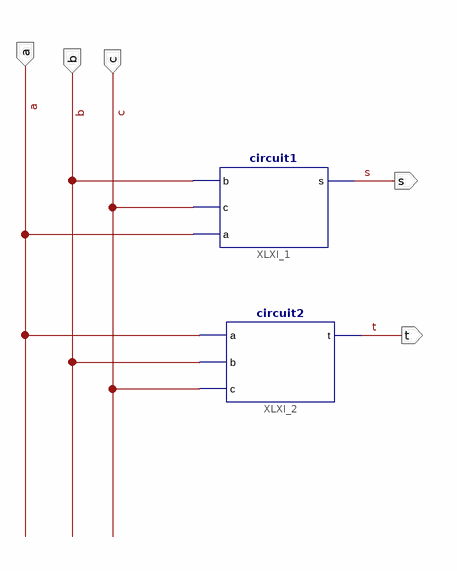
[diagram p0: schematic sheet 1]
// Xilinx ISE schematic toplevel.sch (spartan3e) as structural Verilog: 2 symbols, 5 ports
module toplevel (
  input  c,
  input  a,
  input  b,
  output t,
  output s
);

  circuit1 XLXI_1 (.b(b), .c(c), .a(a), .s(s));
  circuit2 XLXI_2 (.a(a), .b(b), .c(c), .t(t));
endmodule
